# EAGLE design FootKeyboardStandard (EAGLE 7.5.0)
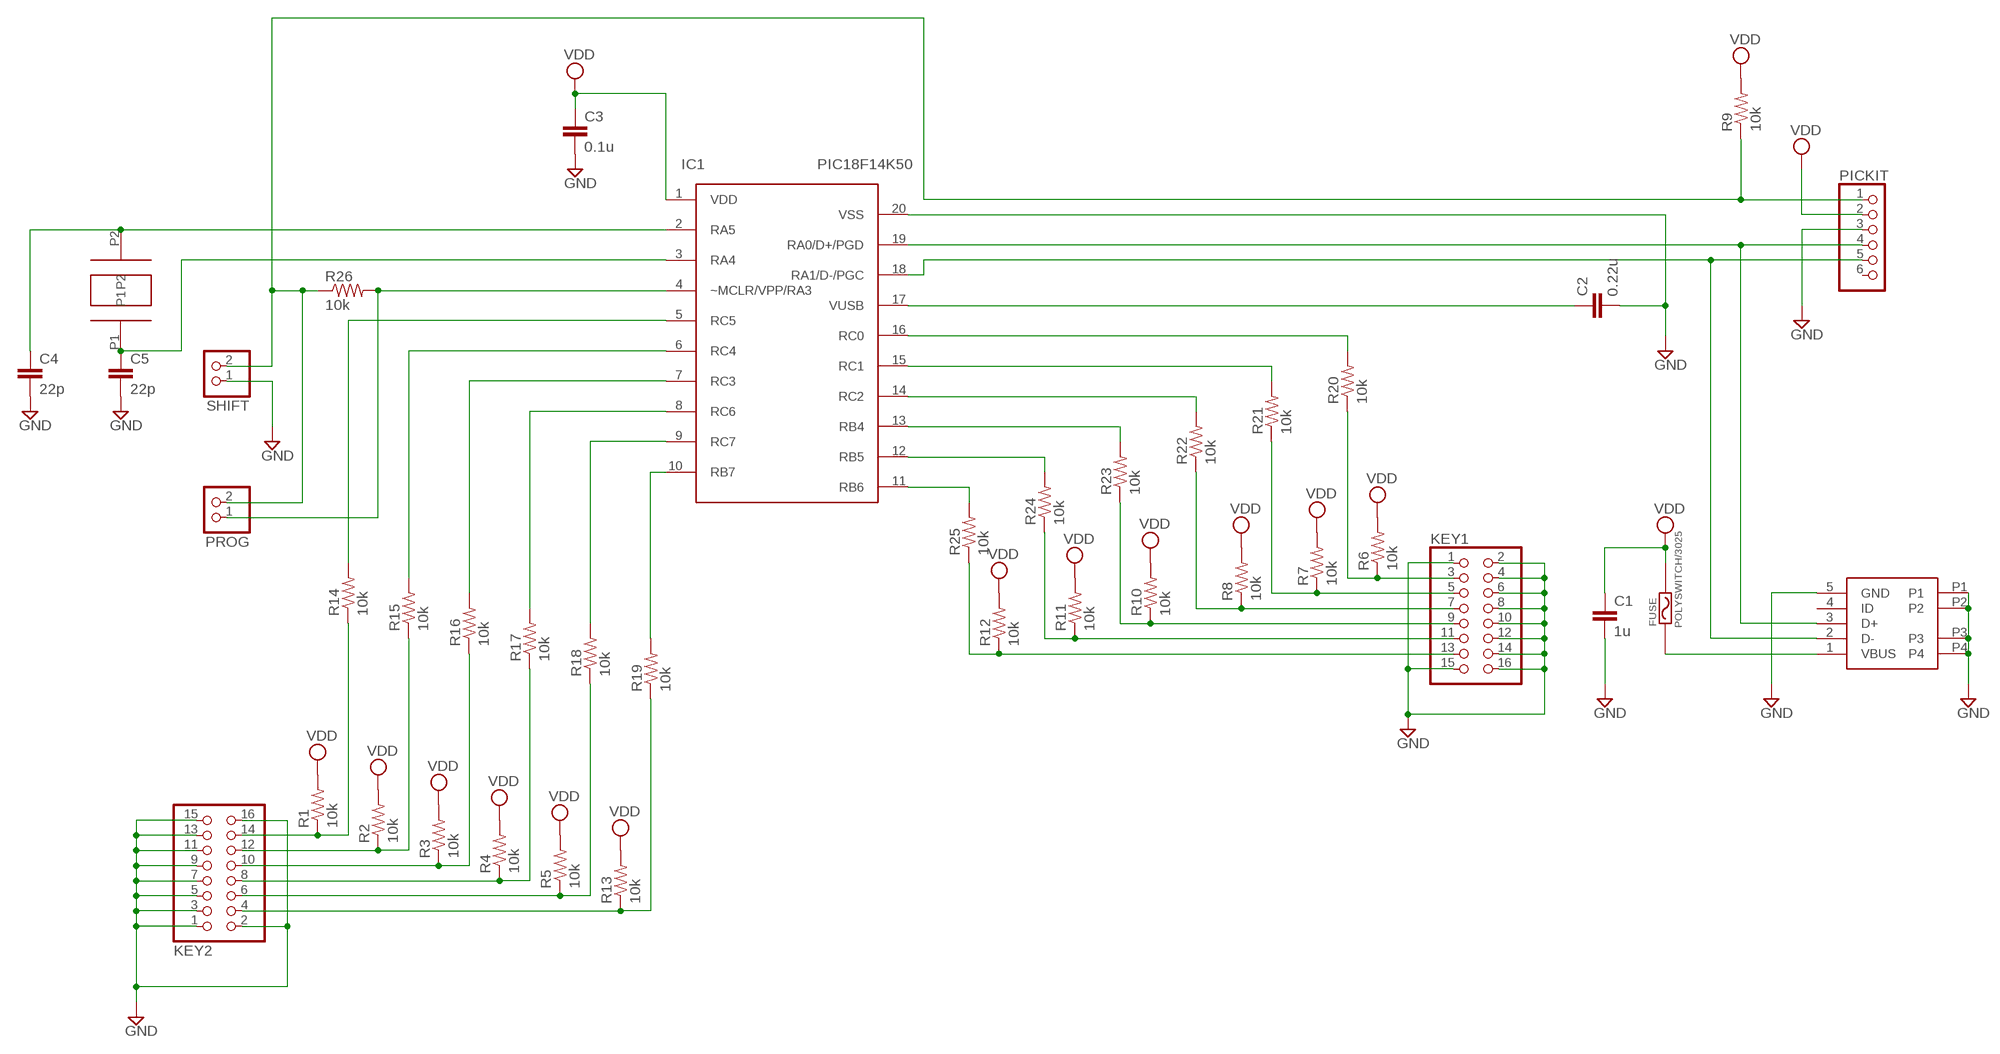
[diagram p0: schematic, sheet 1]

## Parts
C1  1u  C-EU025-025X050  [C025-025X050]
C2  0.22u  C-EU025-025X050  [C025-025X050]
C3  0.1u  C-EU025-025X050  [C025-025X050]
C4  22p  C-EU025-025X050  [C025-025X050]
C5  22p  C-EU025-025X050  [C025-025X050]
FUSE  POLYSWITCH/3025  [SMD/30X25]
IC1  PIC18F14K50  PIC18F1XK50DIP  [DIL20]
KEY1  PINHD-2X8  [2X08]
KEY2  PINHD-2X8  [2X08]
PICKIT  PINHD-1X6  [1X06]
PROG  PINHD-1X2  [1X02]
R1  10k  R-US_0204/7  [0204/7]
R2  10k  R-US_0204/7  [0204/7]
R3  10k  R-US_0204/7  [0204/7]
R4  10k  R-US_0204/7  [0204/7]
R5  10k  R-US_0204/7  [0204/7]
R6  10k  R-US_0204/7  [0204/7]
R7  10k  R-US_0204/7  [0204/7]
R8  10k  R-US_0204/7  [0204/7]
R9  10k  R-US_0204/7  [0204/7]
R10  10k  R-US_0204/7  [0204/7]
R11  10k  R-US_0204/7  [0204/7]
R12  10k  R-US_0204/7  [0204/7]
R13  10k  R-US_0204/7  [0204/7]
R14  10k  R-US_0204/7  [0204/7]
R15  10k  R-US_0204/7  [0204/7]
R16  10k  R-US_0204/7  [0204/7]
R17  10k  R-US_0204/7  [0204/7]
R18  10k  R-US_0204/7  [0204/7]
R19  10k  R-US_0204/7  [0204/7]
R20  10k  R-US_0204/7  [0204/7]
R21  10k  R-US_0204/7  [0204/7]
R22  10k  R-US_0204/7  [0204/7]
R23  10k  R-US_0204/7  [0204/7]
R24  10k  R-US_0204/7  [0204/7]
R25  10k  R-US_0204/7  [0204/7]
R26  10k  R-US_0204/7  [0204/7]
SHIFT  PINHD-1X2  [1X02]
USB  AKIZUKI-USB-MINI-B  [AKIZUKI-USB-MINI-B]
XTAL  12M  AKIZUKI-XTAL  [AKIZUKI-XTAL]

## Nets
GND: C1.2 C2.2 C3.2 C4.2 C5.2 IC1.20(VSS) KEY1.1 KEY1.2 KEY1.4 KEY1.6 KEY1.8 KEY1.10 KEY1.12 KEY1.14 KEY1.15 KEY1.16 KEY2.1 KEY2.2 KEY2.3 KEY2.5 KEY2.7 KEY2.9 KEY2.11 KEY2.13 KEY2.15 KEY2.16 PICKIT.3 SHIFT.1 USB.5(GND) USB.P1 USB.P2 USB.P3 USB.P4
N$1: IC1.19(RA0/D+/PGD) PICKIT.4 USB.3(D+)
N$2: C5.1 IC1.3(RA4) XTAL.P1
N$3: C4.1 IC1.2(RA5) XTAL.P2
N$4: IC1.18(RA1/D-/PGC) PICKIT.5 USB.2(D-)
N$5: IC1.10(RB7) R19.2
N$6 [power]: FUSE.P1 USB.1(VBUS)
N$7: IC1.9(RC7) R18.2
N$9: C2.1 IC1.17(VUSB)
N$10: KEY2.10 R3.1 R16.1
N$11: KEY2.8 R4.1 R17.1
N$12: KEY2.6 R5.1 R18.1
N$13: KEY2.4 R13.1 R19.1
N$14: KEY2.14 R1.1 R14.1
N$15: KEY2.12 R2.1 R15.1
N$16: IC1.8(RC6) R17.2
N$17: IC1.16(RC0) R20.2
N$18: IC1.15(RC1) R21.2
N$19: IC1.14(RC2) R22.2
N$20: KEY1.9 R10.1 R23.1
N$21: KEY1.11 R11.1 R24.1
N$22: KEY1.13 R12.1 R25.1
N$23: IC1.7(RC3) R16.2
N$24: IC1.6(RC4) R15.2
N$25: IC1.5(RC5) R14.2
N$26: KEY1.3 R6.1 R20.1
N$27: KEY1.5 R7.1 R21.1
N$28: KEY1.7 R8.1 R22.1
N$29: IC1.13(RB4) R23.2
N$30: IC1.12(RB5) R24.2
N$31: IC1.11(RB6) R25.2
N$32: PICKIT.1 PROG.2 R9.1 R26.1 SHIFT.2
N$33: IC1.4(~MCLR/VPP/RA3) PROG.1 R26.2
VDD [power]: C1.1 C3.1 FUSE.P2 IC1.1(VDD) PICKIT.2 R1.2 R2.2 R3.2 R4.2 R5.2 R6.2 R7.2 R8.2 R9.2 R10.2 R11.2 R12.2 R13.2
Unconnected: PICKIT.6 USB.4(ID)

## Library data of the parts
C1-C5 = MyParts:C-EU: CAPACITOR, European symbol
FUSE = MyOriginal:POLYSWITCH/3025
IC1 = MyOriginal:PIC18F1XK50: PIC18F1XK50
KEY1 KEY2 = MyParts:PINHD-2X8: PIN HEADER
PICKIT = MyParts:PINHD-1X6: PIN HEADER
PROG SHIFT = MyOriginal:PINHD-1X2: PIN HEADER
R1-R26 = MyParts:R-US_: RESISTOR, American symbol
USB = MyOriginal:AKIZUKI-USB-MINI-B
XTAL = MyOriginal:AKIZUKI-XTAL

## Net classes
0 default: width 0.229 mm, clearance 0.203 mm
1 power: width 0.381 mm, clearance 0.203 mm

## Board
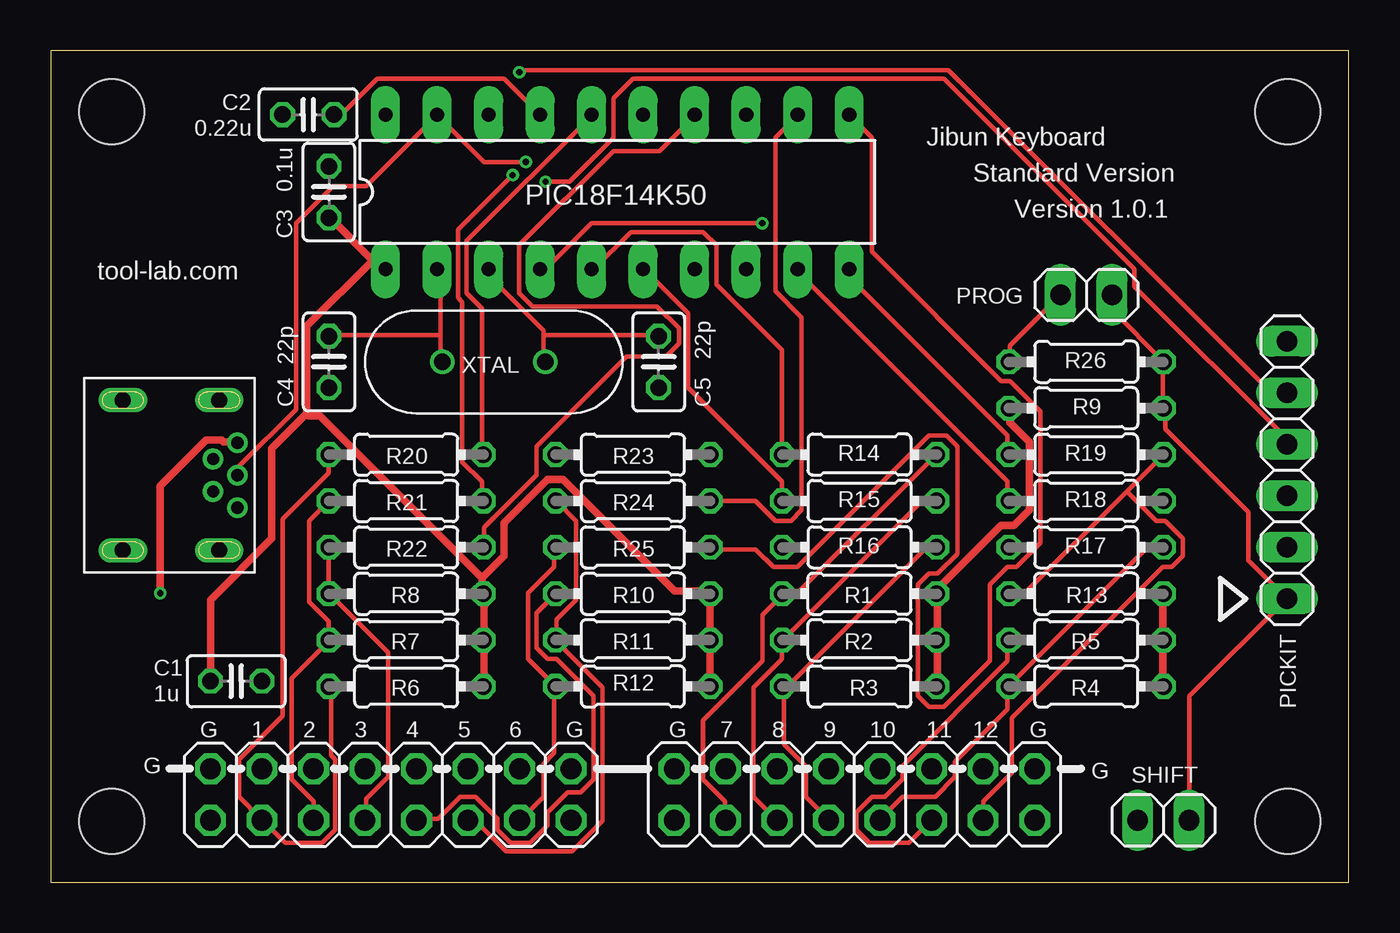
[diagram p1: board, top side]
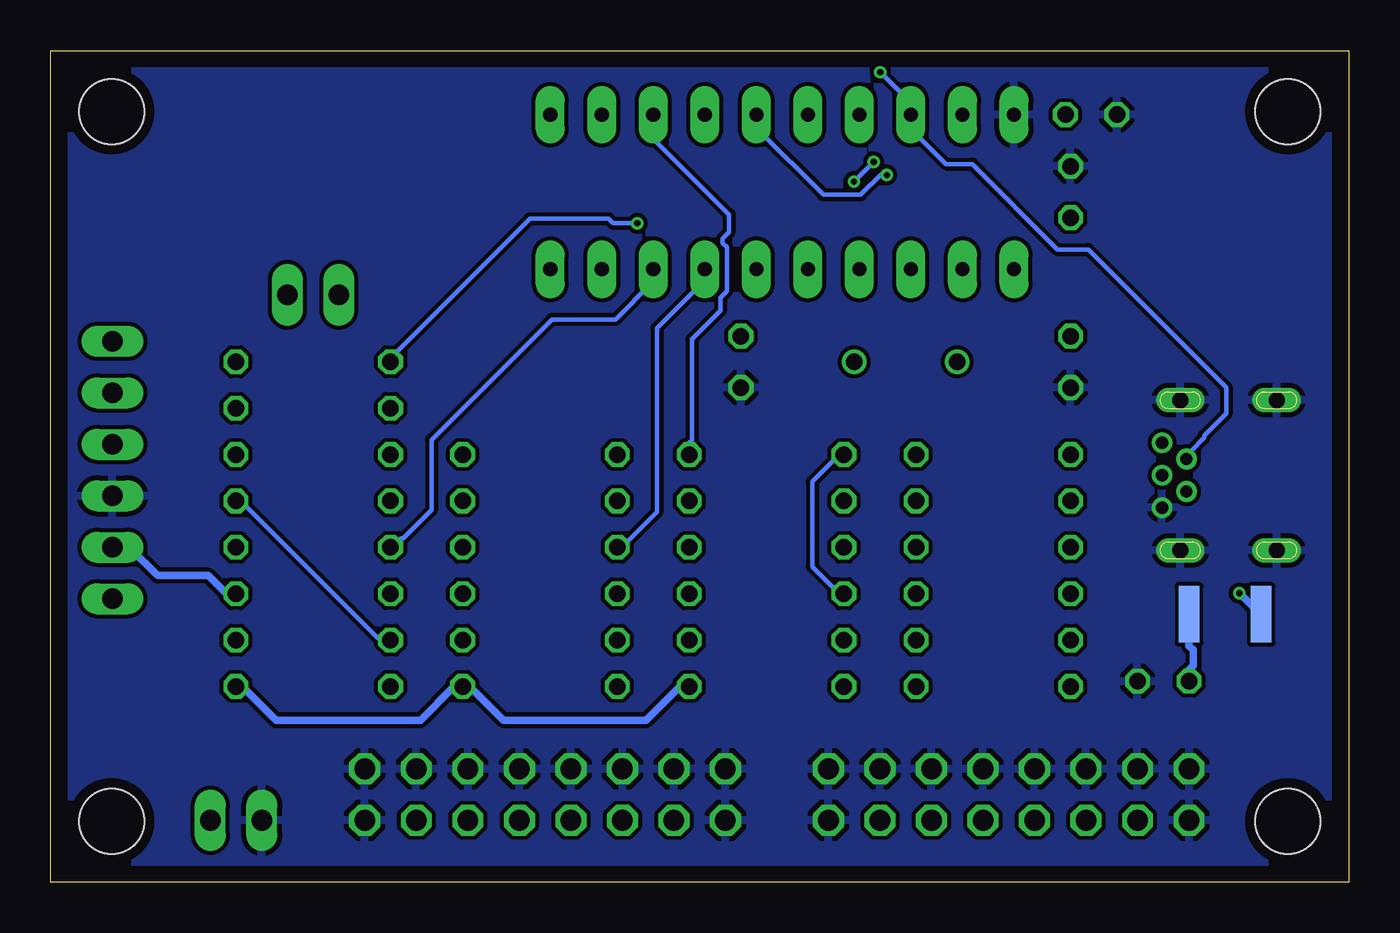
[diagram p2: board, bottom side, seen from below]

Size 64 x 41 mm. Coordinates in mm from the lower left corner, seen from the top.
Outline: 0,0 64,0 64,41 0,41 0,0
Copper layers (1*16): Top 0.035mm / dielectric 1.6mm / Bottom 0.035mm
Design rules "Elecrow_2-layer_PCB_eagle_rule": minimum track width 6mil, minimum drill 12mil, track to track 6mil, track to pad 6mil, pad to pad 6mil, via to via 8mil, smd to smd 0mil, copper to edge 20mil, drill to drill 10mil, minimum pad ring 6mil, minimum via ring 6mil, stop-mask expansion 0mil, vias tented up to drill 100mil, thermal gap 10mil
Holes 3.2 mm at 3,38 3,3 61,38 61,3

### Footprints (pad centres in the part's own frame; a part is rotated, then mirrored left to right if it is on the bottom)
C025-025X050 = drill 0.813 octagon: 1 -1.27,0; 2 1.27,0
SMD/30X25 = smd 1.016 x 2.794: P1 -1.778,0; P2 1.778,0
DIL20 = drill 0.7 pad 1.422 long: 1 -10.16,-3.81; 2 -7.62,-3.81; 3 -5.08,-3.81; 4 -2.54,-3.81; 5 0,-3.81; 6 2.54,-3.81; 7 5.08,-3.81; 8 7.62,-3.81; 9 10.16,-3.81; 10 12.7,-3.81; 11 12.7,3.81; 12 10.16,3.81; 13 7.62,3.81; 14 5.08,3.81; 15 2.54,3.81; 16 0,3.81; 17 -2.54,3.81; 18 -5.08,3.81; 19 -7.62,3.81; 20 -10.16,3.81
2X08 = drill 1.016 octagon: 1 -8.89,-1.27; 2 -8.89,1.27; 3 -6.35,-1.27; 4 -6.35,1.27; 5 -3.81,-1.27; 6 -3.81,1.27; 7 -1.27,-1.27; 8 -1.27,1.27; 9 1.27,-1.27; 10 1.27,1.27; 11 3.81,-1.27; 12 3.81,1.27; 13 6.35,-1.27; 14 6.35,1.27; 15 8.89,-1.27; 16 8.89,1.27
1X06 = drill 1.016 long: 1 -6.35,0; 2 -3.81,0; 3 -1.27,0; 4 1.27,0; 5 3.81,0; 6 6.35,0
1X02 = drill 1.016 long: 1 -1.27,0; 2 1.27,0
0204/7 = drill 0.813 octagon: 1 -3.81,0; 2 3.81,0
AKIZUKI-USB-MINI-B = drill 0.6 pad 1.016: 1 -1.6,5.65; 2 -0.8,4.45; 3 0,5.65; 4 0.8,4.45; 5 1.6,5.65 | drill 0.8 long: P1 -3.7,4.75; P2 -3.7,0; P3 3.7,0; P4 3.7,4.75
AKIZUKI-XTAL = drill 0.8: P1 -2.54,0; P2 2.54,0

### Placement (x,y rotation side)
C1  9.14,9.91 0 top
C2  12.7,37.85 180 top
C3  13.72,34.04 90 top
C4  13.72,25.65 270 top
C5  29.97,25.65 270 top
FUSE  6.1,13.21 180 bottom
IC1  26.67,34.04 0 top
KEY1  16.76,4.32 0 top
KEY2  39.62,4.32 180 top
PICKIT  60.96,20.32 90 top
PROG  51.05,28.96 0 top
R1  39.88,14.22 0 top
R2  39.88,11.94 0 top
R3  39.88,9.65 0 top
R4  51.05,9.65 0 top
R5  51.05,11.94 0 top
R6  17.53,9.65 0 top
R7  17.53,11.94 0 top
R8  17.53,14.22 0 top
R9  51.05,23.37 180 top
R10  28.7,14.22 0 top
R11  28.7,11.94 0 top
R12  28.7,9.65 0 top
R13  51.05,14.22 0 top
R14  39.88,21.08 180 top
R15  39.88,18.8 180 top
R16  39.88,16.51 180 top
R17  51.05,16.51 180 top
R18  51.05,18.8 180 top
R19  51.05,21.08 180 top
R20  17.53,21.08 0 top
R21  17.53,18.8 0 top
R22  17.53,16.51 0 top
R23  28.7,21.08 0 top
R24  28.7,18.8 0 top
R25  28.7,16.51 0 top
R26  51.05,25.65 180 top
SHIFT  54.86,3.05 0 top
USB  3.56,20.07 270 top
XTAL  21.84,25.65 180 top

### Tracks (layer width: path | path; a pad name or v marks a point on that pad's centre or on a via)
GND
  pour Bottom: 1,1 1,40 63,40 63,1
N$1  (via drill 0.3)
  Top 0.229: USB.3 9.28,20.08 9.28,20.51 12.09,23.32 12.09,32.49 13.93,34.33 15.54,34.33 19,37.78 IC1.19 19.11,37.78 21.37,35.52 v23.43,35.52 | v24.4,34.54 25.58,34.54 27.74,36.7 27.74,38.65 28.71,39.62 44.04,39.62 53.44,30.23 53.44,29.36 60.88,21.91 60.88,21.59 PICKIT.4
  Bottom 0.229: v23.43,35.52 v24.4,34.54
N$2
  Top 0.229: 24.29,26.99 24.29,27.2 21.59,29.9 IC1.3 | 24.29,26.99 24.29,25.69 XTAL.P1 | 24.29,26.99 29.9,26.99 C5.1
N$3
  Top 0.229: 19.21,26.99 19.21,30.12 19.11,30.23 IC1.2 | 19.21,26.99 19.21,25.69 XTAL.P2 | 19.21,26.99 13.82,26.99 C4.1
N$4  (via drill 0.3)
  Top 0.229: v23.1,39.94 23.21,40.05 44.26,40.05 60.13,24.18 60.88,24.18 PICKIT.5
  Bottom 0.229: USB.2 7.99,20.94 7.77,21.16 7.77,21.27 7.12,21.91 7.12,22.02 6.04,23.1 6.04,24.4 12.85,31.2 14.36,31.2 18.57,35.41 19.86,35.41 21.59,37.13 IC1.18 21.7,37.89 21.7,38.54 v23.1,39.94
N$5
  Top 0.229: R19.2 47.17,21.16 47.17,22.02 39.4,29.79 39.4,30.23 IC1.10
N$6  (via drill 0.3)
  Top 0.381: v5.4,14.25 5.4,19.54 7.66,21.81 8.42,21.81 8.53,21.7 9.18,21.7 USB.1
  Bottom 0.381: v5.4,14.25 4.32,13.17 FUSE.P1
N$7
  Top 0.229: R18.2 47.17,18.89 47.17,19.75 36.92,30.01 36.92,30.23 IC1.9
N$9
  Top 0.229: C2.1 14.03,37.89 14.36,37.89 16.09,39.62 22.35,39.62 24.07,37.89 IC1.17
N$10
  Top 0.229: KEY2.10 38.32,3.13 37.24,4.21 37.24,5.72 36.16,6.8 36.16,9.61 R3.1 36.27,9.61 43.07,16.41 43.61,16.41 R16.1
N$11
  Top 0.229: KEY2.8 40.91,3.13 41.99,4.21 43.61,4.21 44.58,5.18 44.58,5.94 47.17,8.53 47.17,9.61 R4.1 47.28,9.72 53.98,16.41 54.84,16.41 R17.1
N$12
  Top 0.229: R5.1 47.17,11.87 47.17,10.9 41.99,5.72 41.99,5.07 41.13,4.21 40.48,4.21 39.73,3.45 39.73,2.59 40.37,1.94 42.32,1.94 43.4,3.02 KEY2.6
  Bottom 0.229: R18.1 54.84,18.78 54.62,18.78 47.82,11.98 47.28,11.98 R5.1
N$13
  Top 0.229: 53.06,19.27 54.84,21.05 R19.1 | 53.06,19.27 48.04,14.25 47.28,14.25 R13.1 | 53.06,19.27 54.52,17.81 54.95,17.81 55.81,16.95 55.81,16.09 55.27,15.54 54.84,15.54 47.39,8.1 47.39,5.4 45.99,3.99 45.99,3.13 KEY2.4
N$14
  Top 0.229: R14.1 43.61,21.05 36.81,14.25 36.16,14.25 R1.1 36.05,14.14 35.08,13.17 35.08,10.9 32.17,7.99 32.17,5.07 33.25,3.99 33.25,3.13 KEY2.14
N$15
  Top 0.229: KEY2.12 34.65,4.21 34.65,9.61 36.05,11.01 36.05,11.87 R2.1 36.16,11.98 42.96,18.78 43.61,18.78 R15.1
N$16
  Bottom 0.229: R17.2 47.17,16.52 46.74,16.95 46.63,16.95 45.23,18.35 45.23,21.81 39.29,27.74 36.16,27.74 34.33,29.58 34.33,30.23 IC1.8
N$17
  Top 0.229: R20.2 21.27,21.16 21.27,28.28 20.51,29.04 20.51,31.63 26.66,37.78 IC1.16
N$18  (via drill 0.3)
  Top 0.229: v22.78,34.87 20.08,32.17 20.08,28.82 20.3,28.61 20.3,20.73 21.27,19.75 21.27,18.89 R21.2
  Bottom 0.229: v22.78,34.87 23.1,34.87 24.07,33.9 25.91,33.9 29.15,37.13 29.15,37.78 IC1.15
N$19
  Top 0.229: R22.2 21.37,16.52 21.37,17.49 23.96,20.08 23.96,21.48 28.39,25.91 30.33,25.91 30.98,26.56 30.98,27.31 29.9,28.39 23.75,28.39 23.1,29.04 23.1,31.41 27.74,36.05 30.01,36.05 31.74,37.78 IC1.14
N$20
  Top 0.229: KEY1.9 18.14,3.13 19.11,3.13 20.19,4.21 20.94,4.21 22.02,3.13 22.02,2.59 22.67,1.94 23.64,1.94 24.5,2.81 24.5,3.45 25.48,4.43 26.12,4.43 26.77,5.07 26.77,9.18 24.94,11.01 24.5,11.01 23.96,11.55 23.96,13.28 24.83,14.14 R10.1
  Bottom 0.229: R10.1 24.94,14.25 25.15,14.25 26.45,15.54 26.45,19.75 25.15,21.05 24.94,21.05 R23.1
N$21
  Top 0.229: R24.1 24.94,18.78 25.91,17.81 25.91,13.93 24.94,12.95 24.94,11.98 R11.1 24.94,11.87 27.2,9.61 27.2,3.02 25.69,1.51 22.45,1.51 20.94,3.02 20.62,3.02 KEY1.11
N$22
  Top 0.229: KEY1.13 23.21,3.13 24.29,4.21 24.29,5.83 24.83,6.37 24.83,9.61 R12.1 23.53,11.01 23.53,14.25 24.83,15.54 24.83,16.41 R25.1
N$23
  Bottom 0.229: R16.2 36.05,16.52 35.84,16.52 34.11,18.24 34.11,27.31 31.84,29.58 31.84,30.23 IC1.7
N$24
  Top 0.229: R15.2 36.05,18.89 36.05,19.75 31.41,24.4 31.41,28.07 29.25,30.23 IC1.6
N$25
  Top 0.229: R14.2 36.05,21.16 36.05,26.23 32.82,29.47 32.82,31.41 32.17,32.06 28.61,32.06 26.77,30.23 IC1.5
N$26
  Top 0.229: R6.1 13.82,9.61 13.82,6.26 14.03,6.04 14.03,2.59 13.39,1.94 11.55,1.94 10.47,3.02 KEY1.3 10.36,3.13 9.28,4.21 9.28,6.04 11.44,8.2 11.44,17.92 13.71,20.19 13.71,21.05 R20.1
N$27
  Top 0.229: R21.1 13.71,18.78 12.74,17.81 12.74,13.82 13.71,12.85 13.71,11.98 R7.1 13.71,11.87 11.87,10.04 11.87,5.07 12.95,3.99 KEY1.5
N$28
  Top 0.229: R22.1 13.71,16.41 13.71,14.25 R8.1 13.82,14.14 16.62,11.34 16.62,5.18 15.54,4.1 15.54,3.13 KEY1.7
N$29
  Bottom 0.229: R23.2 32.49,21.16 32.49,21.7 32.38,21.81 32.38,26.77 30.98,28.18 30.98,28.82 30.66,29.15 30.66,31.3 30.87,31.52 30.87,31.74 30.55,32.06 30.55,32.92 34.22,36.59 34.22,37.78 IC1.13
N$30
  Top 0.229: R24.2 32.6,18.78 34.76,18.78 35.73,17.81 36.49,17.81 37.03,18.35 37.03,27.85 35.73,29.15 35.73,36.7 36.81,37.78 IC1.12
N$31
  Top 0.229: R25.2 32.6,16.41 34.76,16.41 35.62,15.54 36.81,15.54 43.29,22.02 44.15,22.02 44.69,21.48 44.69,16.19 43.72,15.22 43.29,15.22 42.75,14.68 42.75,9.18 43.29,8.64 44.04,8.64 46.31,10.9 46.31,14.68 47.17,15.54 47.61,15.54 48.79,16.73 48.79,23.21 47.28,24.72 46.85,24.72 40.48,31.09 40.48,36.7 39.4,37.78 IC1.11
N$32
  Top 0.229: PROG.2 52.36,28.93 52.36,28.18 54.84,25.69 R26.1 54.84,25.58 54.84,23.43 R9.1 54.95,23.32 54.95,22.35 59.05,18.24 59.05,15.87 60.88,14.03 PICKIT.1 60.88,13.93 56.13,9.18 SHIFT.2
N$33  (via drill 0.3)
  Top 0.229: R26.2 47.28,25.69 47.28,26.45 49.77,28.93 PROG.1 | IC1.4 24.4,30.23 26.66,32.49 v35.08,32.49
  Bottom 0.229: v35.08,32.49 36.27,32.49 36.49,32.71 40.37,32.71 47.17,25.91 47.17,25.69 R26.2
VDD
  Top 0.381: R4.2 54.84,9.72 54.84,11.87 R5.2 54.84,12.09 54.84,14.14 R13.2 | R3.2 43.72,9.72 43.72,11.87 R2.2 43.72,12.09 43.72,14.14 R1.2 43.61,14.36 46.85,17.6 47.5,17.6 48.25,18.35 48.25,21.7 47.28,22.67 47.28,23.32 R9.2 | R12.2 32.49,9.72 32.49,11.87 R11.2 32.49,12.09 32.49,14.14 R10.2 32.38,14.36 30.77,14.36 25.26,19.86 24.5,19.86 22.35,17.7 22.35,16.09 21.27,15.01 | R6.2 21.37,9.72 21.37,11.87 R7.2 21.37,12.09 21.37,14.14 R8.2 21.27,14.36 21.27,15.01 | 15.87,30.66 16.3,30.23 IC1.1 | 15.87,30.66 13.82,32.71 C3.1 | 12.63,23.1 10.9,21.37 10.9,16.95 7.88,13.93 7.88,9.93 C1.1 | 12.63,23.1 12.63,27.42 15.87,30.66 | 21.27,15.01 13.28,22.99 12.74,22.99 12.63,23.1
  Bottom 0.381: PICKIT.2 60.88,16.41 60.02,16.41 58.73,15.11 56.24,15.11 55.38,14.25 54.95,14.25 R13.2 | R4.2 54.84,9.61 54.52,9.61 52.9,7.99 45.77,7.99 44.15,9.61 43.72,9.61 R3.2 43.5,9.61 43.29,9.61 41.67,7.99 34.65,7.99 33.03,9.61 32.6,9.61 R12.2 | C1.1 7.88,9.93 7.88,10.47 7.66,10.69 7.66,11.44 7.88,11.66 7.88,13.17 FUSE.P2

### Text on the board
tPlace: Jibun Keyboard | Standard Version | Version 1.0.1 | tool-lab.com | G | 1 | 2 | 3 | 4 | 5 | 6 | G | G | 7 | 8 | 9 | 10 | 11 | 12 | G | G | G